# EAGLE schematic Beilage (EAGLE 9.6.2)
ABTEILUNG: Technische Informatik; BEARBEITER: Ihninger, Grundner; DATUM: 07/02/2022; DOKUMENTART: Schaltplan; GEZ: GruS; ID: 4AHEL; REV: 3; SCHALTPLAN: Sequencer; STATUS: Prototyp; VER: 2.0

## Sheet 1 of 5: Master Control
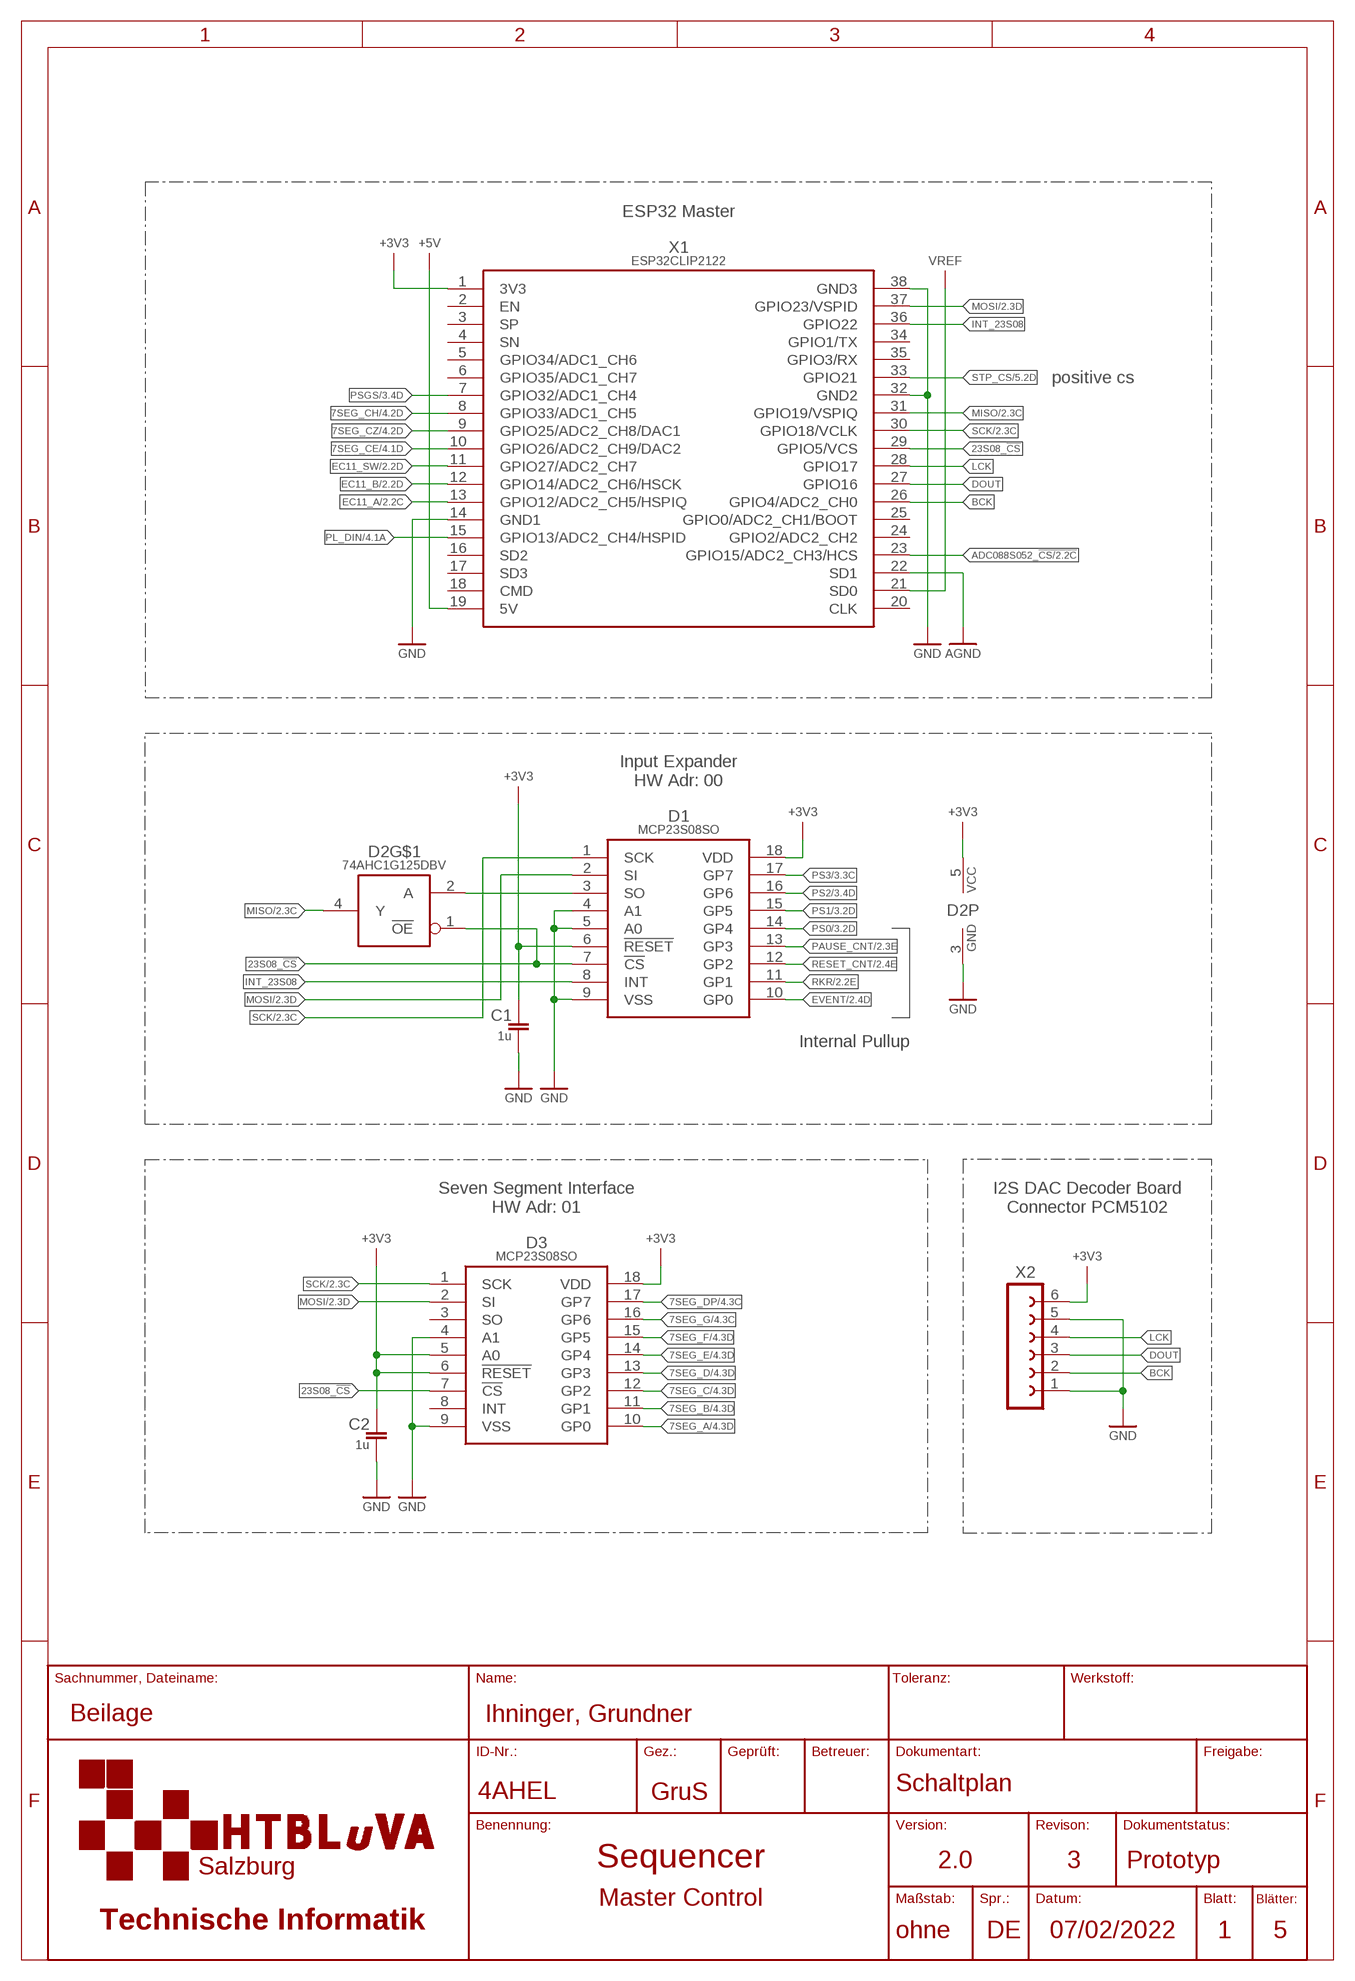
[diagram p0: schematic, sheet 1]

### Parts
C1  1u  C-EUC0805  [C0805]
C2  1u  C-EUC0805  [C0805]
D1  MCP23S08SO  [SO18W]
D2  74AHC1G125DBV  [SOT23-5]
D3  MCP23S08SO  [SO18W]
X1  ESP32CLIP2122  [ESP32-DEVKIT-C-CLIP]
X2  FE06-1  [FE06]

### Nets
7SEG_A: D3.10(GP0) ; also sheet 4
7SEG_B: D3.11(GP1) ; also sheet 4
7SEG_C: D3.12(GP2) ; also sheet 4
7SEG_CE: X1.10(GPIO26/ADC2_CH9/DAC2) ; also sheet 4
7SEG_CH: X1.8(GPIO33/ADC1_CH5) ; also sheet 4
7SEG_CZ: X1.9(GPIO25/ADC2_CH8/DAC1) ; also sheet 4
7SEG_D: D3.13(GP3) ; also sheet 4
7SEG_DP: D3.17(GP7) ; also sheet 4
7SEG_E: D3.14(GP4) ; also sheet 4
7SEG_F: D3.15(GP5) ; also sheet 4
7SEG_G: D3.16(GP6) ; also sheet 4
23S08_!CS: D1.7(!CS) D2.1(!OE) D3.7(!CS) X1.29(GPIO5/VCS)
+3V3: C1.1 C2.1 D1.6(!RESET) D1.18(VDD) D2.5(P:VCC) D3.5(A0) D3.6(!RESET) D3.18(VDD) X1.1(3V3) X2.6 ; also sheet 2,3,5
+5V: X1.19(5V) ; also sheet 2,4
ADC088S052_!CS: X1.23(GPIO15/ADC2_CH3/HCS) ; also sheet 2
AGND: X1.22(SD1) ; also sheet 2
BCK: X1.26(GPIO4/ADC2_CH0) X2.2
DOUT: X1.27(GPIO16) X2.3
EC11_A: X1.13(GPIO12/ADC2_CH5/HSPIQ) ; also sheet 2
EC11_B: X1.12(GPIO14/ADC2_CH6/HSCK) ; also sheet 2
EC11_SW: X1.11(GPIO27/ADC2_CH7) ; also sheet 2
EVENT: D1.10(GP0) ; also sheet 2
GND: C1.2 C2.2 D1.4(A1) D1.5(A0) D1.9(VSS) D2.3(P:GND) D3.4(A1) D3.9(VSS) X1.14(GND1) X1.32(GND2) X1.38(GND3) X2.1 X2.5 ; also sheet 2,3,4,5
INT_23S08: D1.8(INT) X1.36(GPIO22)
LCK: X1.28(GPIO17) X2.4
MISO: D2.4(Y) X1.31(GPIO19/VSPIQ) ; also sheet 2
MOSI: D1.2(SI) D3.2(SI) X1.37(GPIO23/VSPID) ; also sheet 2,5
N$62: D1.3(SO) D2.2(A)
PAUSE_CNT: D1.13(GP3) ; also sheet 2
PL_DIN: X1.15(GPIO13/ADC2_CH4/HSPID) ; also sheet 4
PS0: D1.14(GP4) ; also sheet 3
PS1: D1.15(GP5) ; also sheet 3
PS2: D1.16(GP6) ; also sheet 3
PS3: D1.17(GP7) ; also sheet 3
PSGS: X1.7(GPIO32/ADC1_CH4) ; also sheet 3
RESET_CNT: D1.12(GP2) ; also sheet 2
RKR: D1.11(GP1) ; also sheet 2
SCK: D1.1(SCK) D3.1(SCK) X1.30(GPIO18/VCLK) ; also sheet 2,5
STP_CS: X1.33(GPIO21) ; also sheet 5
VREF: X1.21(SD0) ; also sheet 2
Unconnected: D3.3(SO) D3.8(INT) X1.2(EN) X1.3(SP) X1.4(SN) X1.5(GPIO34/ADC1_CH6) X1.6(GPIO35/ADC1_CH7) X1.16(SD2) X1.17(SD3) X1.18(CMD) X1.20(CLK) X1.24(GPIO2/ADC2_CH2) X1.25(GPIO0/ADC2_CH1/BOOT) X1.34(GPIO1/TX) X1.35(GPIO3/RX)

### Notes on the sheet
- ESP32 Master
- positive cs
- Input Expander
  HW Adr: 00
- Internal Pullup
- Seven Segment Interface
  HW Adr: 01
- I2S DAC Decoder Board
  Connector PCM5102

## Sheet 2 of 5: User Inputs Potentiometers for Pitch Settings Switch Inputs EC-11
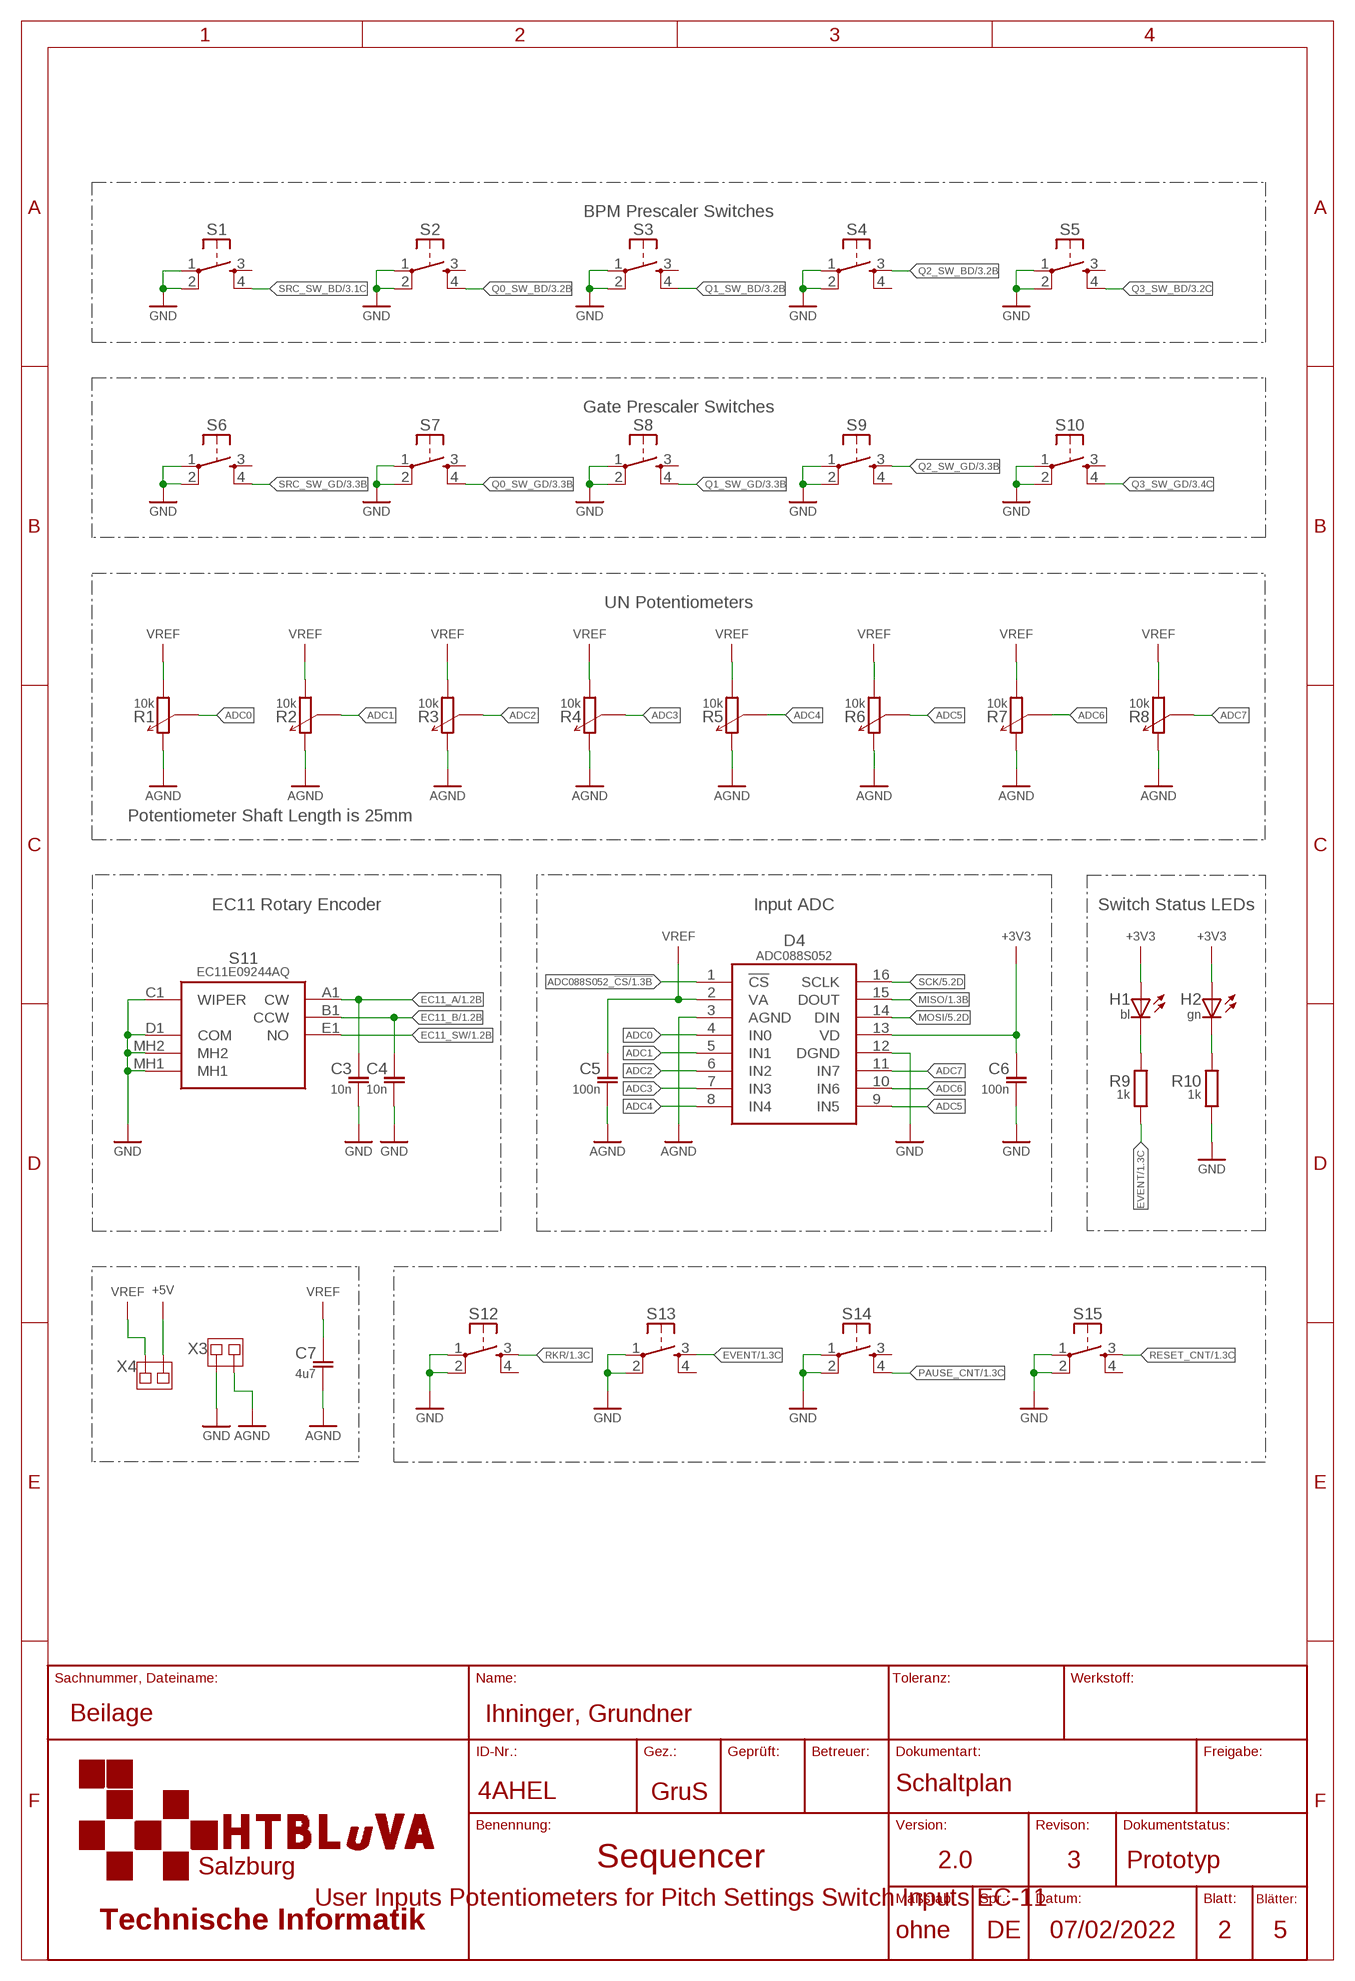
[diagram p1: schematic, sheet 2]

### Parts
C3  10n  C-EUC0805  [C0805]
C4  10n  C-EUC0805  [C0805]
C5  100n  C-EUC0805  [C0805]
C6  100n  C-EUC0805  [C0805]
C7  4u7  C-EUC0805  [C0805]
D4  ADC088S052  [TSSOP16]
H1  bl  LEDCHIPLED_1206  [CHIPLED_1206]
H2  gn  LEDCHIPLED_1206  [CHIPLED_1206]
R1  10k  P160LB  [P160LB]
R2  10k  P160LB  [P160LB]
R3  10k  P160LB  [P160LB]
R4  10k  P160LB  [P160LB]
R5  10k  P160LB  [P160LB]
R6  10k  P160LB  [P160LB]
R7  10k  P160LB  [P160LB]
R8  10k  P160LB  [P160LB]
R9  1k  R-EUSR0805  [R0805]
R10  1k  R-EUSR0805  [R0805]
S1  TASTE10XX  [B3F-10XX]
S2  TASTE10XX  [B3F-10XX]
S3  TASTE10XX  [B3F-10XX]
S4  TASTE10XX  [B3F-10XX]
S5  TASTE10XX  [B3F-10XX]
S6  TASTE10XX  [B3F-10XX]
S7  TASTE10XX  [B3F-10XX]
S8  TASTE10XX  [B3F-10XX]
S9  TASTE10XX  [B3F-10XX]
S10  TASTE10XX  [B3F-10XX]
S11  EC11E09244AQ  [EC11]
S12  TASTE10XX  [B3F-10XX]
S13  TASTE10XX  [B3F-10XX]
S14  TASTE10XX  [B3F-10XX]
S15  TASTE10XX  [B3F-10XX]
X3  JUMPSMD1FACH-1  [MYLIB_SJ]
X4  JUMPSMD1FACH-1  [MYLIB_SJ]

### Nets
+3V3: C6.1 D4.13(VD) H1.A H2.A ; also sheet 1,3,5
+5V: X4.1 ; also sheet 1,4
ADC0: D4.4(IN0) R1.2
ADC1: D4.5(IN1) R2.2
ADC2: D4.6(IN2) R3.2
ADC3: D4.7(IN3) R4.2
ADC4: D4.8(IN4) R5.2
ADC5: D4.9(IN5) R6.2
ADC6: D4.10(IN6) R7.2
ADC7: D4.11(IN7) R8.2
ADC088S052_!CS: D4.1(!CS) ; also sheet 1
AGND: C5.2 C7.2 D4.3(AGND) R1.3 R2.3 R3.3 R4.3 R5.3 R6.3 R7.3 R8.3 X3.2 ; also sheet 1
EC11_A: C3.1 S11.A1(CW) ; also sheet 1
EC11_B: C4.1 S11.B1(CCW) ; also sheet 1
EC11_SW: S11.E1(NO) ; also sheet 1
EVENT: R9.1 S13.3(S) ; also sheet 1
GND: C3.2 C4.2 C6.2 D4.12(DGND) R10.1 S1.1(P) S1.2(P1) S2.1(P) S2.2(P1) S3.1(P) S3.2(P1) S4.1(P) S4.2(P1) S5.1(P) S5.2(P1) S6.1(P) S6.2(P1) S7.1(P) S7.2(P1) S8.1(P) S8.2(P1) S9.1(P) S9.2(P1) S10.1(P) S10.2(P1) S11.C1(WIPER) S11.D1(COM) S11.MH1 S11.MH2 S12.1(P) S12.2(P1) S13.1(P) S13.2(P1) S14.1(P) S14.2(P1) S15.1(P) S15.2(P1) X3.1 ; also sheet 1,3,4,5
MISO: D4.15(DOUT) ; also sheet 1
MOSI: D4.14(DIN) ; also sheet 1,5
N$9: H2.C R10.2
N$58: H1.C R9.2
PAUSE_CNT: S14.4(S1) ; also sheet 1
Q0_SW_BD: S2.4(S1) ; also sheet 3
Q0_SW_GD: S7.4(S1) ; also sheet 3
Q1_SW_BD: S3.4(S1) ; also sheet 3
Q1_SW_GD: S8.4(S1) ; also sheet 3
Q2_SW_BD: S4.3(S) ; also sheet 3
Q2_SW_GD: S9.3(S) ; also sheet 3
Q3_SW_BD: S5.4(S1) ; also sheet 3
Q3_SW_GD: S10.4(S1) ; also sheet 3
RESET_CNT: S15.3(S) ; also sheet 1
RKR: S12.3(S) ; also sheet 1
SCK: D4.16(SCLK) ; also sheet 1,5
SRC_SW_BD: S1.4(S1) ; also sheet 3
SRC_SW_GD: S6.4(S1) ; also sheet 3
VREF: C5.1 C7.1 D4.2(VA) R1.1 R2.1 R3.1 R4.1 R5.1 R6.1 R7.1 R8.1 X4.2 ; also sheet 1
Unconnected: S1.3(S) S2.3(S) S3.3(S) S4.4(S1) S5.3(S) S6.3(S) S7.3(S) S8.3(S) S9.4(S1) S10.3(S) S12.4(S1) S13.4(S1) S14.3(S) S15.4(S1)

### Notes on the sheet
- BPM Prescaler Switches
- Gate Prescaler Switches
- UN Potentiometers
- Potentiometer Shaft Length is 25mm
- EC11 Rotary Encoder | Input ADC | Switch Status LEDs

## Sheet 3 of 5: Prescaler
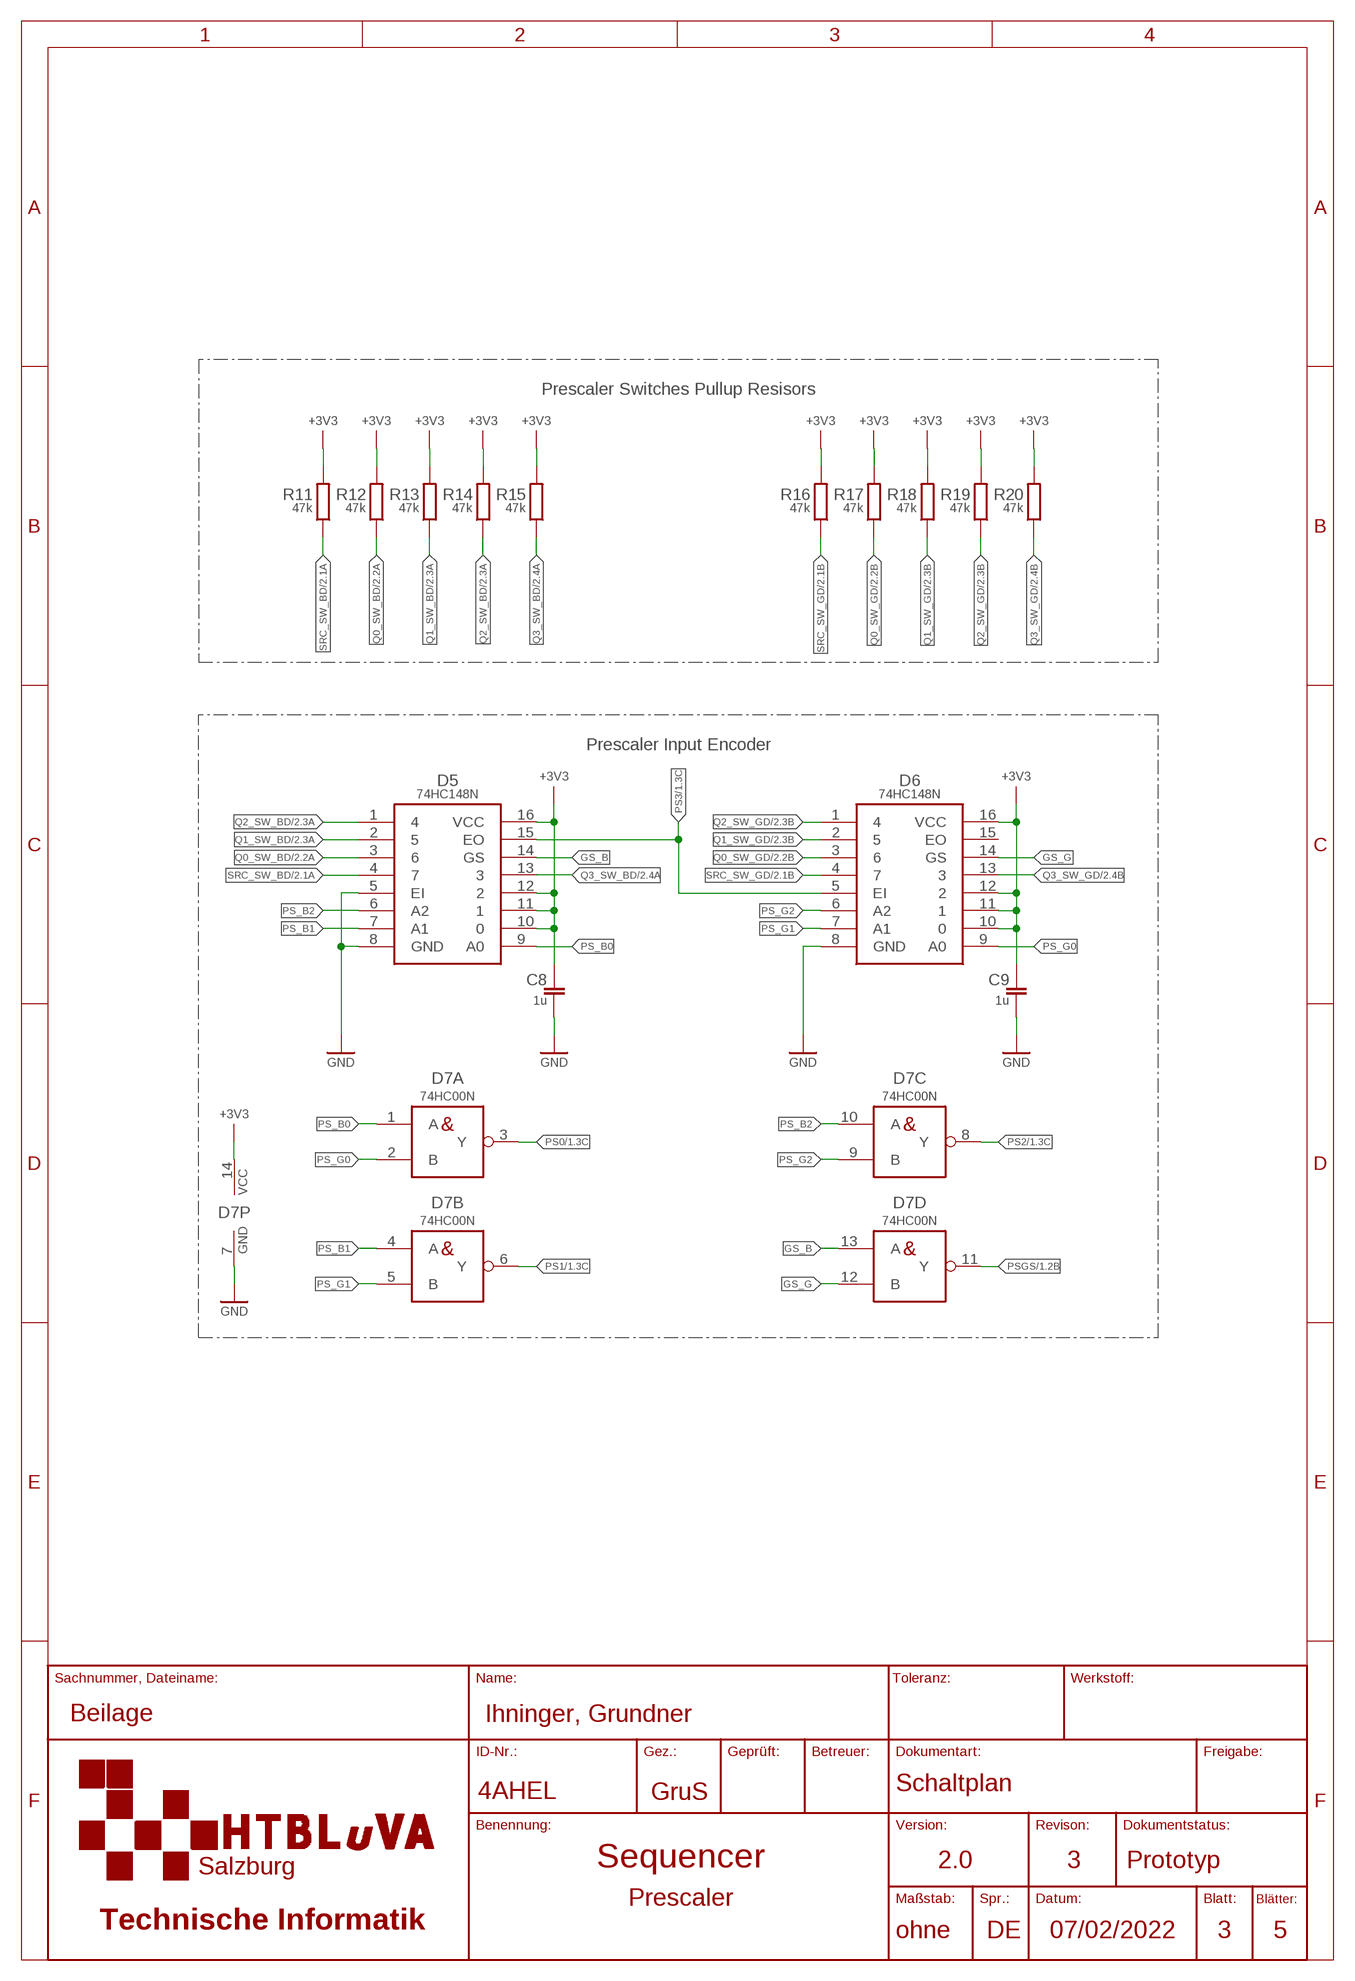
[diagram p2: schematic, sheet 3]

### Parts
C8  1u  C-EUC0805  [C0805]
C9  1u  C-EUC0805  [C0805]
D5  74HC148N  [DIP16]
D6  74HC148N  [DIP16]
D7  74HC00N  [DIP14]
R11  47k  R-EUSR0805  [R0805]
R12  47k  R-EUSR0805  [R0805]
R13  47k  R-EUSR0805  [R0805]
R14  47k  R-EUSR0805  [R0805]
R15  47k  R-EUSR0805  [R0805]
R16  47k  R-EUSR0805  [R0805]
R17  47k  R-EUSR0805  [R0805]
R18  47k  R-EUSR0805  [R0805]
R19  47k  R-EUSR0805  [R0805]
R20  47k  R-EUSR0805  [R0805]

### Nets
+3V3: C8.1 C9.1 D5.10 D5.11 D5.12 D5.16(VCC) D6.10 D6.11 D6.12 D6.16(VCC) D7.14(P:VCC) R11.2 R12.2 R13.2 R14.2 R15.2 R16.2 R17.2 R18.2 R19.2 R20.2 ; also sheet 1,2,5
GND: C8.2 C9.2 D5.5(EI) D5.8(GND) D6.8(GND) D7.7(P:GND) ; also sheet 1,2,4,5
GS_B: D5.14(GS) D7.13(D:A)
GS_G: D6.14(GS) D7.12(D:B)
PS0: D7.3(A:Y) ; also sheet 1
PS1: D7.6(B:Y) ; also sheet 1
PS2: D7.8(C:Y) ; also sheet 1
PS3: D5.15(EO) D6.5(EI) ; also sheet 1
PS_B0: D5.9(A0) D7.1(A:A)
PS_B1: D5.7(A1) D7.4(B:A)
PS_B2: D5.6(A2) D7.10(C:A)
PS_G0: D6.9(A0) D7.2(A:B)
PS_G1: D6.7(A1) D7.5(B:B)
PS_G2: D6.6(A2) D7.9(C:B)
PSGS: D7.11(D:Y) ; also sheet 1
Q0_SW_BD: D5.3 R12.1 ; also sheet 2
Q0_SW_GD: D6.3 R17.1 ; also sheet 2
Q1_SW_BD: D5.2 R13.1 ; also sheet 2
Q1_SW_GD: D6.2 R18.1 ; also sheet 2
Q2_SW_BD: D5.1 R14.1 ; also sheet 2
Q2_SW_GD: D6.1 R19.1 ; also sheet 2
Q3_SW_BD: D5.13 R15.1 ; also sheet 2
Q3_SW_GD: D6.13 R20.1 ; also sheet 2
SRC_SW_BD: D5.4 R11.1 ; also sheet 2
SRC_SW_GD: D6.4 R16.1 ; also sheet 2
Unconnected: D6.15(EO)

### Notes on the sheet
- Prescaler Switches Pullup Resisors
- Prescaler Input Encoder

## Sheet 4 of 5: Display & LEDs PL9823-F5 Rotating LEDs 7 Segment Display
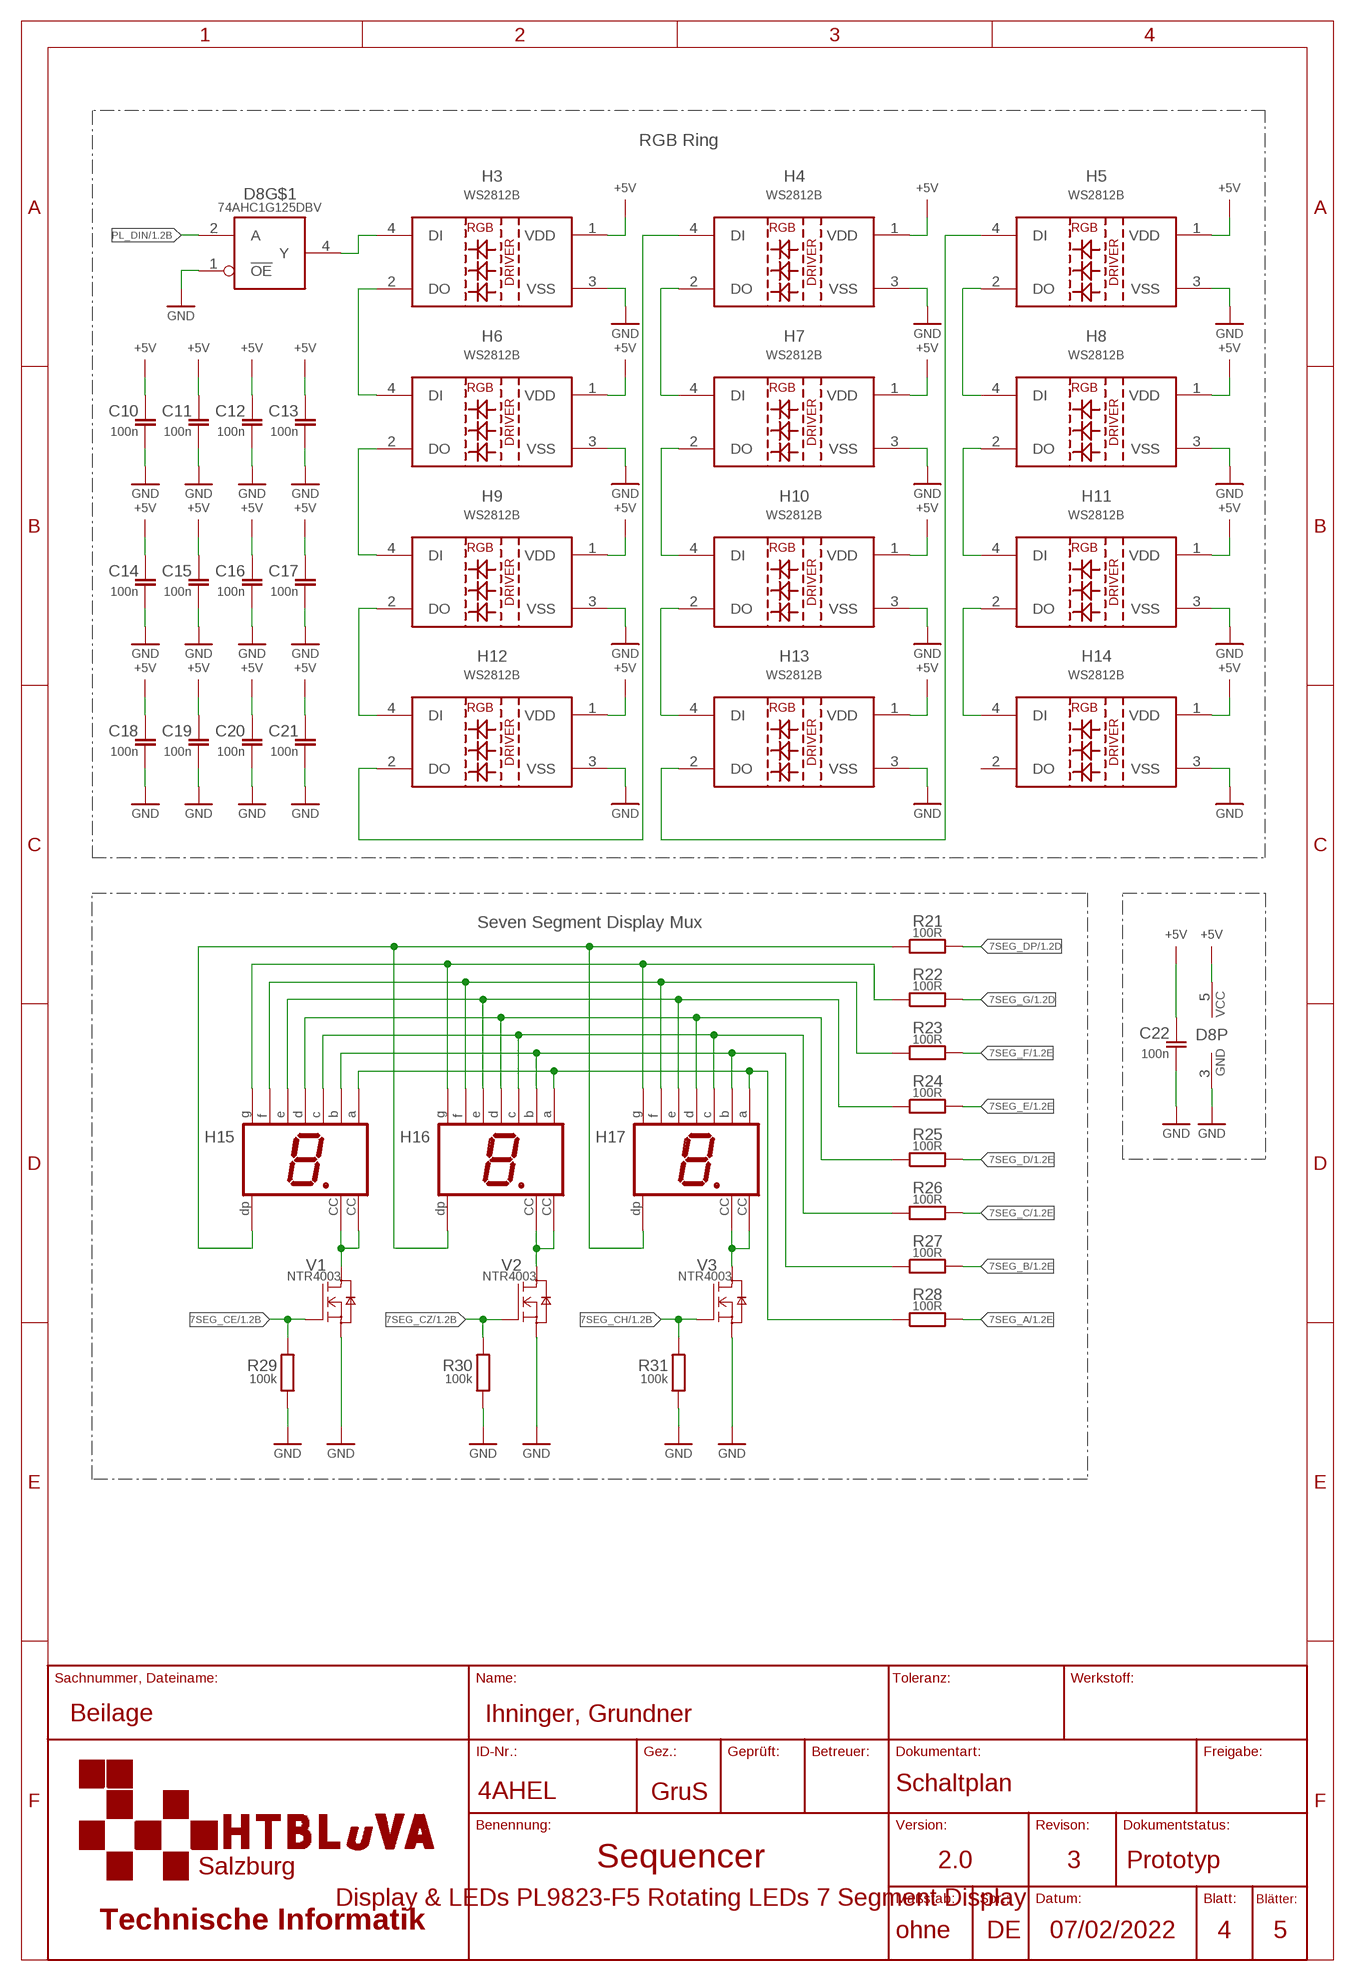
[diagram p3: schematic, sheet 4]

### Parts
C10  100n  C-EUC0805  [C0805]
C11  100n  C-EUC0805  [C0805]
C12  100n  C-EUC0805  [C0805]
C13  100n  C-EUC0805  [C0805]
C14  100n  C-EUC0805  [C0805]
C15  100n  C-EUC0805  [C0805]
C16  100n  C-EUC0805  [C0805]
C17  100n  C-EUC0805  [C0805]
C18  100n  C-EUC0805  [C0805]
C19  100n  C-EUC0805  [C0805]
C20  100n  C-EUC0805  [C0805]
C21  100n  C-EUC0805  [C0805]
C22  100n  C-EUC0805  [C0805]
D8  74AHC1G125DBV  [SOT23-5]
H3  WS2812B  [WS2812B]
H4  WS2812B  [WS2812B]
H5  WS2812B  [WS2812B]
H6  WS2812B  [WS2812B]
H7  WS2812B  [WS2812B]
H8  WS2812B  [WS2812B]
H9  WS2812B  [WS2812B]
H10  WS2812B  [WS2812B]
H11  WS2812B  [WS2812B]
H12  WS2812B  [WS2812B]
H13  WS2812B  [WS2812B]
H14  WS2812B  [WS2812B]
H15  HD-H103  [HDSP-E]
H16  HD-H103  [HDSP-E]
H17  HD-H103  [HDSP-E]
R21  100R  R-EU_R0805  [R0805]
R22  100R  R-EU_R0805  [R0805]
R23  100R  R-EU_R0805  [R0805]
R24  100R  R-EU_R0805  [R0805]
R25  100R  R-EU_R0805  [R0805]
R26  100R  R-EU_R0805  [R0805]
R27  100R  R-EU_R0805  [R0805]
R28  100R  R-EU_R0805  [R0805]
R29  100k  R-EUSR0805  [R0805]
R30  100k  R-EUSR0805  [R0805]
R31  100k  R-EUSR0805  [R0805]
V1  NTR4003  [SOT23]
V2  NTR4003  [SOT23]
V3  NTR4003  [SOT23]

### Nets
7SEG_A: R28.2 ; also sheet 1
7SEG_B: R27.2 ; also sheet 1
7SEG_C: R26.2 ; also sheet 1
7SEG_CE: R29.2 V1.1(G) ; also sheet 1
7SEG_CH: R31.2 V3.1(G) ; also sheet 1
7SEG_CZ: R30.2 V2.1(G) ; also sheet 1
7SEG_D: R25.2 ; also sheet 1
7SEG_DP: R21.2 ; also sheet 1
7SEG_E: R24.2 ; also sheet 1
7SEG_F: R23.2 ; also sheet 1
7SEG_G: R22.2 ; also sheet 1
+5V: C10.1 C11.1 C12.1 C13.1 C14.1 C15.1 C16.1 C17.1 C18.1 C19.1 C20.1 C21.1 C22.1 D8.5(P:VCC) H3.1(VDD) H4.1(VDD) H5.1(VDD) H6.1(VDD) H7.1(VDD) H8.1(VDD) H9.1(VDD) H10.1(VDD) H11.1(VDD) H12.1(VDD) H13.1(VDD) H14.1(VDD) ; also sheet 1,2
GND: C10.2 C11.2 C12.2 C13.2 C14.2 C15.2 C16.2 C17.2 C18.2 C19.2 C20.2 C21.2 C22.2 D8.1(!OE) D8.3(P:GND) H3.3(VSS) H4.3(VSS) H5.3(VSS) H6.3(VSS) H7.3(VSS) H8.3(VSS) H9.3(VSS) H10.3(VSS) H11.3(VSS) H12.3(VSS) H13.3(VSS) H14.3(VSS) R29.1 R30.1 R31.1 V1.2(S) V2.2(S) V3.2(S) ; also sheet 1,2,3,5
N$1: D8.4(Y) H3.4(DI)
N$2: H6.2(DO) H9.4(DI)
N$3: H3.2(DO) H6.4(DI)
N$4: H8.2(DO) H11.4(DI)
N$7: H15.DP H16.DP H17.DP R21.1
N$33: H15.G H16.G H17.G R22.1
N$35: H15.F H16.F H17.F R23.1
N$36: H15.A H16.A H17.A R28.1
N$37: H15.B H16.B H17.B R27.1
N$55: H15.CC1(CC) H15.CC2(CC) V1.3(D)
N$56: H15.D H16.D H17.D R25.1
N$57: H10.2(DO) H13.4(DI)
N$59: H5.4(DI) H13.2(DO)
N$63: H5.2(DO) H8.4(DI)
N$64: H16.CC1(CC) H16.CC2(CC) V2.3(D)
N$65: H17.CC1(CC) H17.CC2(CC) V3.3(D)
N$67: H7.2(DO) H10.4(DI)
N$68: H9.2(DO) H12.4(DI)
N$69: H11.2(DO) H14.4(DI)
N$70: H4.4(DI) H12.2(DO)
N$73: H4.2(DO) H7.4(DI)
N$78: H15.C H16.C H17.C R26.1
N$80: H15.E H16.E H17.E R24.1
PL_DIN: D8.2(A) ; also sheet 1
Unconnected: H14.2(DO)

### Notes on the sheet
- RGB Ring
- Seven Segment Display Mux

## Sheet 5 of 5: LED Driver LED Register PL-9823-F5 LEDs
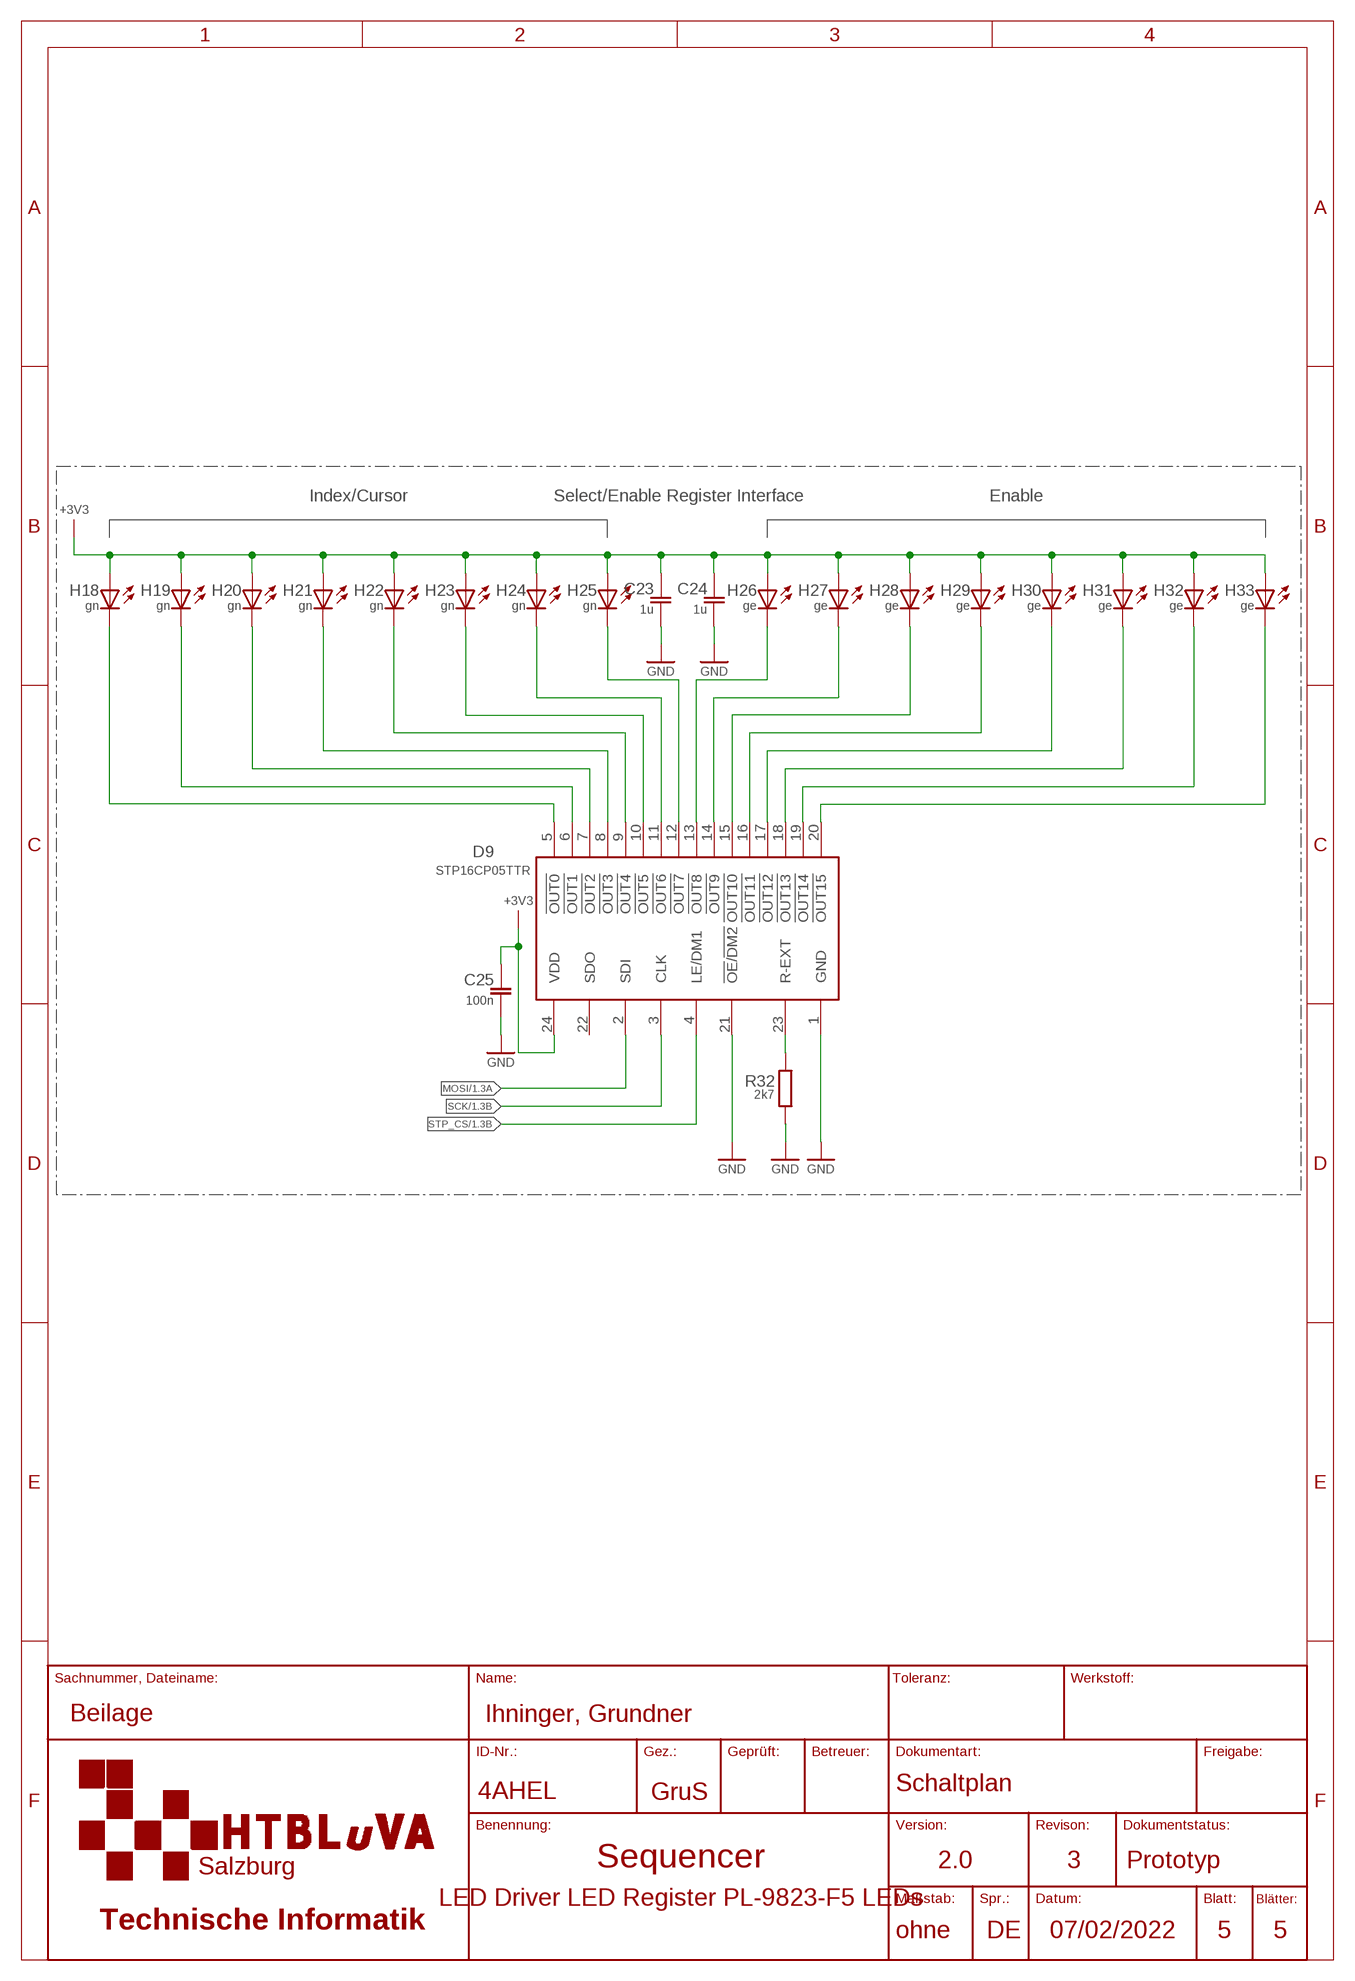
[diagram p4: schematic, sheet 5]

### Parts
C23  1u  C-EUC0805  [C0805]
C24  1u  C-EUC0805  [C0805]
C25  100n  C-EUC0805  [C0805]
D9  STP16CP05TTR  [TSSOP24]
H18  gn  LED5MM  [LED5MM]
H19  gn  LED5MM  [LED5MM]
H20  gn  LED5MM  [LED5MM]
H21  gn  LED5MM  [LED5MM]
H22  gn  LED5MM  [LED5MM]
H23  gn  LED5MM  [LED5MM]
H24  gn  LED5MM  [LED5MM]
H25  gn  LED5MM  [LED5MM]
H26  ge  LED5MM  [LED5MM]
H27  ge  LED5MM  [LED5MM]
H28  ge  LED5MM  [LED5MM]
H29  ge  LED5MM  [LED5MM]
H30  ge  LED5MM  [LED5MM]
H31  ge  LED5MM  [LED5MM]
H32  ge  LED5MM  [LED5MM]
H33  ge  LED5MM  [LED5MM]
R32  2k7  R-EUSR0805  [R0805]

### Nets
+3V3: C23.1 C24.1 C25.1 D9.24(VDD) H18.A H19.A H20.A H21.A H22.A H23.A H24.A H25.A H26.A H27.A H28.A H29.A H30.A H31.A H32.A H33.A ; also sheet 1,2,3
GND: C23.2 C24.2 C25.2 D9.1(GND) D9.21(!OE!/!DM2) R32.1 ; also sheet 1,2,3,4
MOSI: D9.2(SDI) ; also sheet 1,2
N$38: D9.5(!OUT0) H18.K(C)
N$39: D9.6(!OUT1) H19.K(C)
N$40: D9.7(!OUT2) H20.K(C)
N$41: D9.8(!OUT3) H21.K(C)
N$42: D9.9(!OUT4) H22.K(C)
N$43: D9.10(!OUT5) H23.K(C)
N$44: D9.11(!OUT6) H24.K(C)
N$45: D9.12(!OUT7) H25.K(C)
N$46: D9.13(!OUT8) H26.K(C)
N$47: D9.14(!OUT9) H27.K(C)
N$48: D9.15(!OUT10) H28.K(C)
N$49: D9.16(!OUT11) H29.K(C)
N$50: D9.17(!OUT12) H30.K(C)
N$51: D9.18(!OUT13) H31.K(C)
N$52: D9.19(!OUT14) H32.K(C)
N$53: D9.20(!OUT15) H33.K(C)
N$54: D9.23(R-EXT) R32.2
SCK: D9.3(CLK) ; also sheet 1,2
STP_CS: D9.4(LE/DM1) ; also sheet 1
Unconnected: D9.22(SDO)

### Notes on the sheet
- Index/Cursor | Select/Enable Register Interface | Enable

## Library data of the parts
C1-C25 = rcl_GruS:C-EU: CAPACITOR, European symbol; CATEGORY: 2
D1 D3 = ic_GruS:MCP23S08: 8-bit I/O Expander,SPI,MCP23S08-E/SO Source: Datasheet <https://datasheet.datasheetarchive.com/originals/distributors/SFDatasheet-4/sf-00090055.pdf>; ARROW_PART_NUMBER: MCP23S08-E/SO; ARROW_PRICE-STOCK: https://www.arrow.com/en/products/mcp23s08-eso/microchip-technology?region=nac; CATEGORY: 13; DESCRIPTION: 8-bit I/O Expander,SPI,MCP23S08-E/SO; HEIGHT: 2.65mm; MANUFACTURER_NAME: Microchip; MANUFACTURER_PART_NUMBER: MCP23S08-E/SO; MOUSER_PART_NUMBER: 579-MCP23S08-E/SO; MOUSER_PRICE-STOCK: https://www.mouser.co.uk/ProductDetail/Microchip-Technology/MCP23S08-E-SO?qs=Sez7gRs8XSXMFunLZ5Ve%2FA%3D%3D
D2 D8 = 74xx_GruS:74*1G125: Single Bus Buffer Gate with 3-State Output; CATEGORY: 13
D4 = adc-dac_GruS:ADC088S052: 8-Channel, 200 ksps to 500 ksps, 8-Bit A/D Converter Source: Datasheet <http://www.ti.com/lit/gpn/adc088s052>; ARROW_PART_NUMBER: ADC088S052CIMT/NOPB; ARROW_PRICE-STOCK: https://www.arrow.com/en/products/adc088s052cimtnopb/texas-instruments?region=nac; CATEGORY: 2; DESCRIPTION: 8-Channel, 200 ksps to 500 ksps, 8-Bit A/D Converter; HEIGHT: 1.2mm; MANUFACTURER_NAME: Texas Instruments; MANUFACTURER_PART_NUMBER: ADC088S052CIMT/NOPB; MOUSER_PART_NUMBER: 926-AD088S052CIMTNPB; MOUSER_PRICE-STOCK: https://www.mouser.co.uk/ProductDetail/Texas-Instruments/ADC088S052CIMT-NOPB?qs=7X5t%252BdzoRHDIs0QC27A8hw%3D%3D
D5 D6 = 74xx_GruS:74*148: Priority encoder,SN74HC148N DIL16 25pcs Source: Datasheet <http://www.ti.com/lit/gpn/sn74hc148>; CATEGORY: 13
D7 = 74xx_GruS:74*00: Quad 2-Input Logic NAND Datasheet Dist.: Art. Nr.:; CATEGORY: 13
D9 = ic_GruS:STP16CP05: STP16CP05 Source: Datasheet <http://www.st.com/st-web-ui/static/active/en/resource/technical/document/datasheet/CD00126634.pdf>; CATEGORY: 13
H1 H2 H18-H33 = led_GruS:LED: LED, EN-60617 OSRAM: - CHIPLED LG R971, LG N971, LY N971, LG Q971, LY Q971, LO R971, LY R971 LH N974, LH R974 LS Q976, LO Q976, LY Q976 LO Q996 - Hyper CHIPLED LW Q18S LB Q993, LB Q99A, LB R99A - SideLED LS A670, LO A670, LY A670, LG A670, LP A670 LB A673, LV A673, LT A673, LW A673 LH A674 LY A675 LS A676, LA A676, LO A676, LY A676, LW A676 LS A679, LY A679, LG A679 - Hyper Micro SIDELED® LS Y876, LA Y876, LO Y876, LY Y876 LT Y87S - SmartLED LW L88C, LW L88S LB L89C, LB L89S, LG L890 LS L89K, LO L89K, LY L89K LS L896, LA L896, LO L896, LY L896 - TOPLED LS T670, LO T670, LY T670, LG T670, LP T670 LSG T670, LSP T670, LSY T670, LOP T670, LYG T670 LG T671, LOG T671, LSG T671 LB T673, LV T673, LT T673, LW T673 LH T674 LS T676, LA T676, LO T676, LY T676, LB T676, LH T676, LSB T676, LW T676 LB T67C, LV T67C, LT T67C, LS T67K, LO T67K, LY T67K, LW E67C LS E67B, LA E67B, LO E67B, LY E67B, LB E67C, LV E67C, LT E67C LW T67C LS T679, LY T679, LG T679 LS T770, LO T770, LY T770, LG T770, LP T770 LB T773, LV T773, LT T773, LW T773 LH T774 LS E675, LA E675, LY E675, LS T675 LS T776, LA T776, LO T776, LY T776, LB T776 LHGB T686 LT T68C, LB T68C - Hyper Mini TOPLED® LB M676 - Mini TOPLED Santana® LG M470 LS M47K, LO M47K, LY M47K Source: http://www.osram.convergy.de LUXEON: - LUMILED® LXK2-PW12-R00, LXK2-PW12-S00, LXK2-PW14-U00, LXK2-PW14-V00 LXK2-PM12-R00, LXK2-PM12-S00, LXK2-PM14-U00 LXK2-PE12-Q00, LXK2-PE12-R00, LXK2-PE12-S00, LXK2-PE14-T00, LXK2-PE14-U00 LXK2-PB12-K00, LXK2-PB12-L00, LXK2-PB12-M00, LXK2-PB14-N00, LXK2-PB14-P00, LXK2-PB14-Q00 LXK2-PR12-L00, LXK2-PR12-M00, LXK2-PR14-Q00, LXK2-PR14-R00 LXK2-PD12-Q00, LXK2-PD12-R00, LXK2-PD12-S00 LXK2-PH12-R00, LXK2-PH12-S00 LXK2-PL12-P00, LXK2-PL12-Q00, LXK2-PL12-R00 Source: www.luxeon.com KINGBRIGHT: KA-3528ASYC Source: www.kingbright.com; CATEGORY: 7
H3-H14 = led_GruS:WS2812B; CATEGORY: 7
H15-H17 = display_GruS:HD-H103: LED DISPLAY 1-character 7 segment, decimal point right; CATEGORY: 15; OC_FARNELL: unknown; OC_NEWARK: unknown
R1-R8 = rcl_GruS:P160: Datasheet P160 <https://www.ttelectronics.com/TTElectronics/media/ProductFiles/Datasheets/P160.pdf> DigiKey Collection <https://www.digikey.com/en/products/filter/rotary-potentiometers-rheostats/84?s=N4IgjCBcoEwCxVAYygMwIYBsDOBTANCAPZQDaIcADDAGxgwgC6hADgC5QgDKbATgJYA7AOYgAvoRoBORCBSQMOAsTIgAzAA41NAKwNmIdpx4CR4wjB0bZ8xXkIlI5TXA1WmrDpG58hoiSA6agjQcmhY9ipO6gDslDQaEAZG3iZ%2B5oFwOjbhSg6q2jAxGpQehl4%2Bpv6EGlI0OQoRyo7OJcEIyRVpZgFglFoNds0FajCJ1p3Gvj2EfVIMobZN%2BdHaOmBgHZ5TVRlgGnAyi7mRLeBlKSAAkoJsuMK4vHtStYPLUeSlk6nT1SAwMH2bzyH3O3xAABEiABXABGmFwGQAtCFkCdhtFLBpLEwAkjssdGiCzmAYrjCEiIIShityC8yYwxEygA>
R9-R20 R29-R32 = rcl_GruS:R-EUS: RESISTOR, European symbol
R21-R28 = rcl_GruS:R-EU_: RESISTOR, European symbol
S1-S10 S12-S15 = switch_GruS:TASTE10XX: OMRON SWITCH; CATEGORY: 17
S11 = switch_GruS:EC11: Alps 9 Pulse Incremental Mechanical Rotary Encoder with a 6 mm Flat Shaft (Not Indexed), Through Hole// Source: Datasheet <https://componentsearchengine.com/Datasheets/2/EC11E09244BS.pdf>; CATEGORY: 17; DESCRIPTION: Alps 9 Pulse Incremental Mechanical Rotary Encoder with a 6 mm Flat Shaft (Not Indexed), Through Hole//; HEIGHT: 24.5mm; MANUFACTURER_NAME: ALPS; MANUFACTURER_PART_NUMBER: EC11E09244AQ; MOUSER_PART_NUMBER: 688-EC11E09244AQ; MOUSER_PRICE-STOCK: https://www.mouser.com/Search/Refine.aspx?Keyword=688-EC11E09244AQ
V1-V3 = mfet_GruS:NTR4003: Datasheet <https://www.mouser.de/datasheet/2/308/1/NTR4003N_D-2319203.pdf>; CATEGORY: 5
X1 = modul_GruS:ESP32; CATEGORY: 18
X2 = con-lsta:FE06-1: FEMALE HEADER; CATEGORY: 18
X3 X4 = con_GruS:JUMPSMD1FACH-1: SMD solder JUMPER; CATEGORY: 18